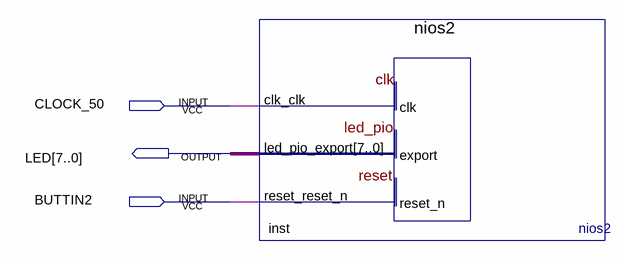
[diagram p0: schematic sheet]
// Quartus schematic nios2.bdf as structural Verilog: 1 symbols, 3 pins
module nios2 (
  input  CLOCK_50,
  input  BUTTIN2,
  output [7:0] LED
);

  nios2 inst (.clk_clk(CLOCK_50), .reset_reset_n(BUTTIN2), .led_pio_export(LED));
endmodule
